# Altium schematic sheet SCH005.SchDoc: Digital Inputs
size A4; Date: 07-02-2024; DrawnBy: Nikhil Premjani; SheetNumber: 5; SheetTotal: 6; ModelNumber: EM411-202401-RMC001; ModelName: Remote Manipulation Controller
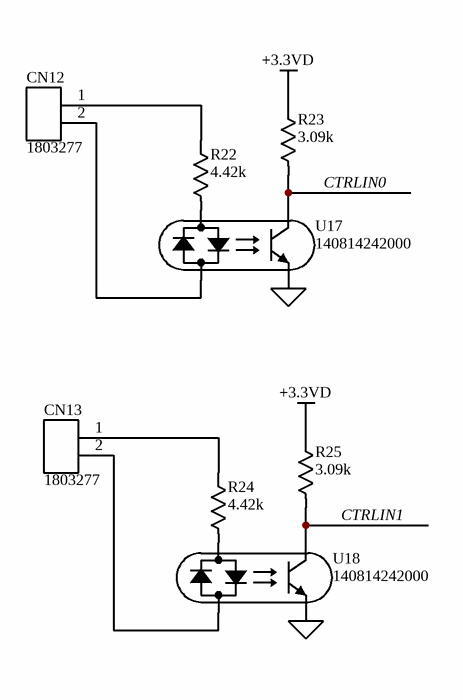
[diagram p0: SCH005.SchDoc]

## Parts
CN12  1803277  [PHOENIX_1803277]
CN13  1803277  [PHOENIX_1803277]
R22  4.42k  [RESC2012X06N]
R23  3.09k  [RESC2012X06N]
R24  4.42k  [RESC2012X06N]
R25  3.09k  [RESC2012X06N]
U17  140814242000  [WURTH_140814242000]
U18  140814242000  [WURTH_140814242000]

## Nets
+3.3VD: R23.2 R25.2
GND: U17.3(E) U18.3(E)
CTRLIN0: R23.1 U17.4(C)
CTRLIN1: R25.1 U18.4(C)
NetCN12_1: CN12.1 R22.2
NetCN12_2: CN12.2 U17.2(K)
NetCN13_1: CN13.1 R24.2
NetCN13_2: CN13.2 U18.2(K)
NetR22_1: R22.1 U17.1(A)
NetR24_1: R24.1 U18.1(A)

## Notes on the sheet
- Model Number
- Model Name
- Revision
- Title
- Date
- Sheet
- of
- File
- Drawn by

## Library data of the parts
CN12 CN13 = 1803277: MC 1,5/2G-3,81 Pluggable Terminal Block 2 Pos 3.81mm pitch Through Hole Header; Manufacturer: Phoenix Contact; PartNumber: 1803277
R22 R24 = CR0805-FX-4421ELF: 4.42k, 1%, 0.125W Thick Film Chip Resistor; Manufacturer: Bourns; PartNumber: CR0805-FX-4421ELF
R23 R25 = CR0805-FX-3091ELF: 3.09k, 1%, 0.125W Thick Film Chip Resistor; Manufacturer: Bourns; PartNumber: CR0805-FX-3091ELF
U17 U18 = 140814242000: WL-OCPT Optocoupler Phototransistor; Manufacturer: Wurth Elektronik; PartNumber: 140814242000